# Altium schematic sheet Intelligent_Agriculture_Power.SchDoc
size A4
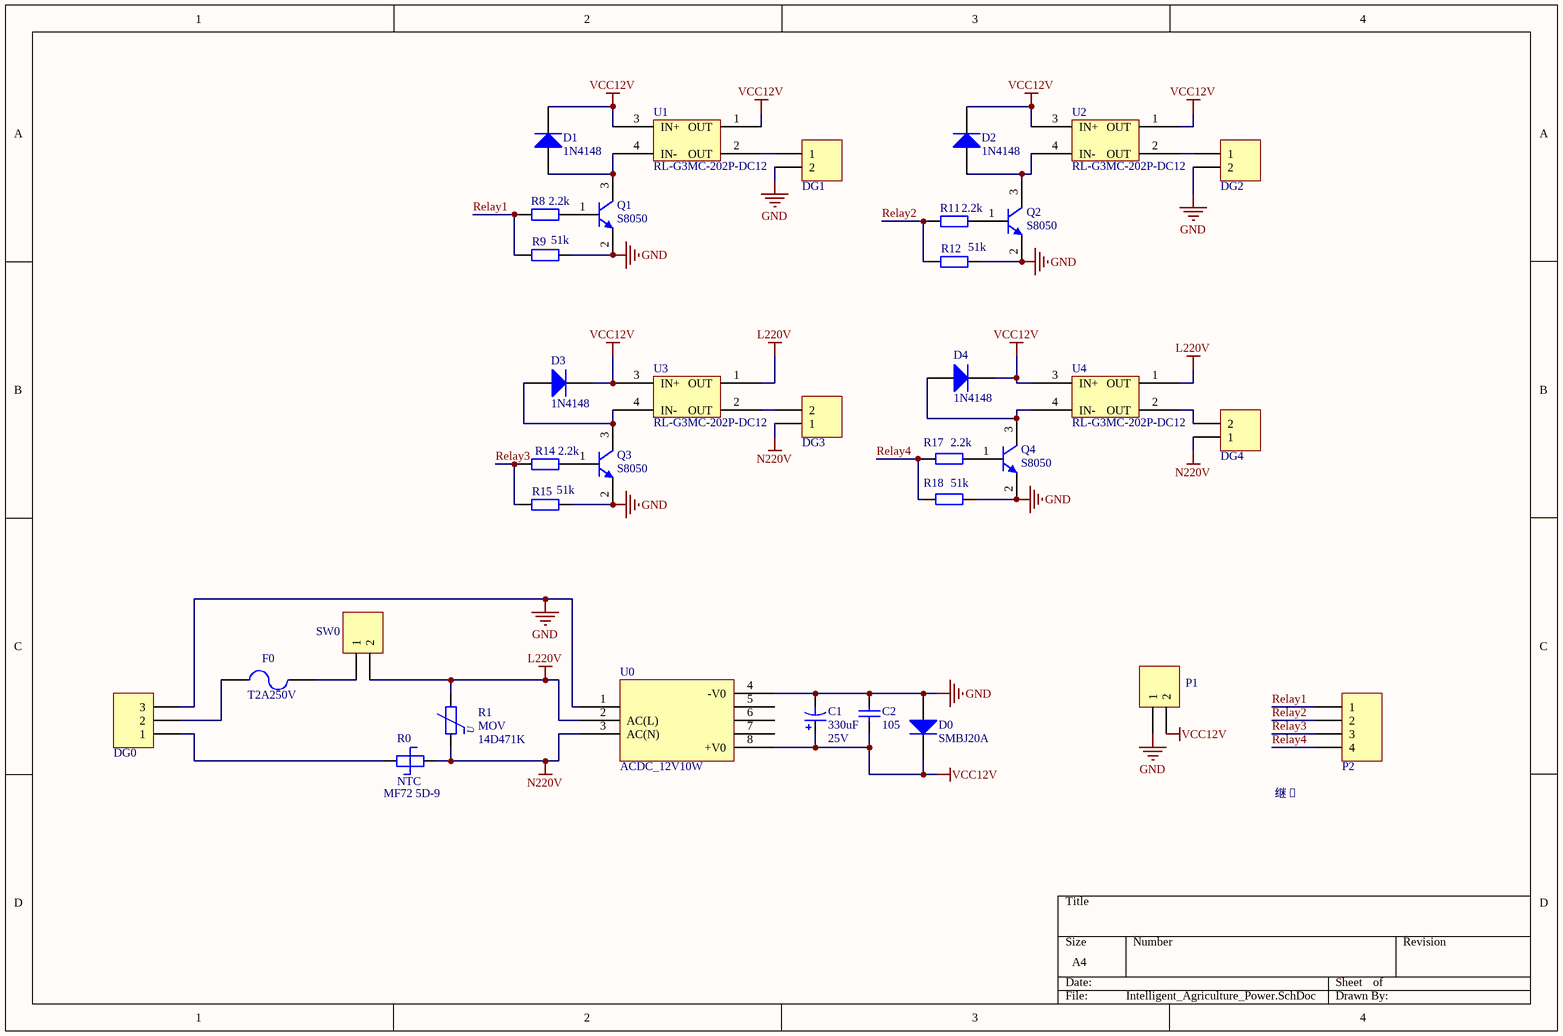
[diagram p0: Intelligent_Agriculture_Power.SchDoc]

## Parts
C1  value 330uF  Vol: 25V  [C-RB-2.54]  (hidden comment: Cap Pol1)
C2  value 105  [C-RAD-0805]  (hidden comment: Cap)
D0  value SMBJ20A  [DIODE-1206]  (hidden comment: Diode)
D1  value 1N4148  [DIODE-1206]  (hidden comment: Diode)
D2  value 1N4148  [DIODE-1206]  (hidden comment: Diode)
D3  value 1N4148  [DIODE-1206]  (hidden comment: Diode)
D4  value 1N4148  [DIODE-1206]  (hidden comment: Diode)
DG0  Header 3  [DG301-3P]  (value not drawn)
DG1  Header 2  [HDR2X1_C]  (value not drawn)
DG2  Header 2  [HDR2X1_C]  (value not drawn)
DG3  Header 2  [HDR2X1_C]  (value not drawn)
DG4  Header 2  [HDR2X1_C]  (value not drawn)
F0  value T2A250V  [1812]  (hidden comment: Fuse)
P1  Header 2  [HDR2X1_B1]  (value not drawn)
P2  Header 4  [HDR4X1_B1]  (value not drawn)
Q1  S8050  [SOT-23]
Q2  S8050  [SOT-23]
Q3  S8050  [SOT-23]
Q4  S8050  [SOT-23]
R0  NTC  value MF72 5D-9  [0805-1]
R1  MOV  value 14D471K  [0805-1]
R8  value 2.2k  [0805-1]  (hidden comment: Res1)
R9  value 51k  [0805-1]  (hidden comment: Res1)
R11  value 2.2k  [0805-1]  (hidden comment: Res1)
R12  value 51k  [0805-1]  (hidden comment: Res1)
R14  value 2.2k  [0805-1]  (hidden comment: Res1)
R15  value 51k  [0805-1]  (hidden comment: Res1)
R17  value 2.2k  [0805-1]  (hidden comment: Res1)
R18  value 51k  [0805-1]  (hidden comment: Res1)
SW0  Header 2  [HDR2X1_C]  (value not drawn)
U0  ACDC_12V10W  [ACDC_XTQ10B-12W]
U1  RL-G3MC-202P-DC12  [RL-G3MC-202P-DC12]
U2  RL-G3MC-202P-DC12  [RL-G3MC-202P-DC12]
U3  RL-G3MC-202P-DC12  [RL-G3MC-202P-DC12]
U4  RL-G3MC-202P-DC12  [RL-G3MC-202P-DC12]

## Nets
GND: C1.2 C2.2 D0.1(A) DG0.3 DG1.2 DG2.2 P1.1 Q1.2(E) Q2.2(E) Q3.2(E) Q4.2(E) R9.2 R12.2 R15.2 R18.2 U0.1 U0.4(-V0)
L220V: R1.2 SW0.2 U0.2(AC(L)) U3.1(OUT) U4.1(OUT)
N220V: DG3.1 DG4.1 R0.2 R1.1 U0.3(AC(N))
VCC12V: C1.1 C2.1 D0.2(K) D1.2(K) D2.2(K) D3.2(K) D4.2(K) P1.2 U0.8(+V0) U1.1(OUT) U1.3(IN+) U2.1(OUT) U2.3(IN+) U3.3(IN+) U4.3(IN+)
Relay1: P2.1 R8.2 R9.1
Relay2: P2.2 R11.2 R12.1
Relay3: P2.3 R14.2 R15.1
Relay4: P2.4 R17.2 R18.1
NetD1_1: D1.1(A) Q1.3(C) U1.4(IN-)
NetD2_1: D2.1(A) Q2.3(C) U2.4(IN-)
NetD3_1: D3.1(A) Q3.3(C) U3.4(IN-)
NetD4_1: D4.1(A) Q4.3(C) U4.4(IN-)
NetDG0_1: DG0.1 R0.1
NetDG0_2: DG0.2 F0.1
NetDG1_1: DG1.1 U1.2(OUT)
NetDG2_1: DG2.1 U2.2(OUT)
NetDG3_2: DG3.2 U3.2(OUT)
NetDG4_2: DG4.2 U4.2(OUT)
NetF0_2: F0.2 SW0.1
NetQ1_1: Q1.1(B) R8.1
NetQ2_1: Q2.1(B) R11.1
NetQ3_1: Q3.1(B) R14.1
NetQ4_1: Q4.1(B) R17.1

Not connected (* = marked no-connect by the designer): U0 5 6 7

## Notes on the sheet
- 继�
- (in symbol MOV) U

## Library data of the parts
C1 = Cap P: 电解电容; Published: 8-Jun-2000; LatestRevisionDate: 17-Jul-2002; LatestRevisionNote: Re-released for DXP Platform.; PackageReference: RB7.6-15; Publisher: Altium Limited; PackageDescription: Polarized Capacitor (Radial); 2 Leads
C2 = Cap: 无极性电容; Published: 8-Jun-2000; LatestRevisionDate: 17-Jul-2002; LatestRevisionNote: Re-released for DXP Platform.; PackageReference: RAD-0.3; Publisher: Altium Limited
D0-D4 = Dio: 二极管; Published: 8-Jun-2000; LatestRevisionDate: 17-Jul-2002; LatestRevisionNote: Re-released for DXP Platform.; PackageDocument: Sep-1996; PackageReference: SMC; Publisher: Altium Limited; Code_JEDEC: DO-214-AB
DG0 = Header: 接插件; Value: 排针; LatestRevisionDate: 17-Jul-2002; LatestRevisionNote: Re-released for DXP Platform.; Publisher: Altium Limited
DG1 DG2 = Header 2: 接插件; LatestRevisionDate: 17-Jul-2002; LatestRevisionNote: Re-released for DXP Platform.; Publisher: Altium Limited
DG3 DG4 SW0 = Header 2: 接插件; Value: 5.08-301-3P; LatestRevisionDate: 17-Jul-2002; LatestRevisionNote: Re-released for DXP Platform.; Publisher: Altium Limited
F0 = Fuse: 保险丝; Published: 8-Jun-2000; LatestRevisionDate: 17-Jul-2002; LatestRevisionNote: Re-released for DXP Platform.; PackageReference: PIN-W2/E2.8; Publisher: Altium Limited
P1 = Header 2: 接插件; Value: XH2.54-2P; LatestRevisionDate: 17-Jul-2002; LatestRevisionNote: Re-released for DXP Platform.; Publisher: Altium Limited
P2 = Header 4: 接插件; Value: XH2.54-4P; LatestRevisionDate: 17-Jul-2002; LatestRevisionNote: Re-released for DXP Platform.; Publisher: Altium Limited
Q1-Q4 = BCP: NPN三极管; Published: 17-Sep-2003; LatestRevisionDate: 12-Dec-2006; LatestRevisionNote: IPC-7351 Footprint Added.; DatasheetVersion: 8-Apr-1999; PackageVersion: Aug-2001; PackageReference: SOT223; Publisher: Altium Limited; PackageDescription: 4-Pin SOT-223 Package 2.3 mm Pitch, 7 mm Lead Span; ComponentLink1Description: Manufacturer Link; ComponentLink1URL: http://www.semiconductors.philips.com/; ComponentLink2Description: Datasheet; ComponentLink2URL: http://www.semiconductors.philips.com/acrobat/datasheets/BCP68_4.pdf; Value: S8050
R0 = NTC: 热敏电阻; Published: 8-Jun-2000; LatestRevisionDate: 17-Jul-2002; LatestRevisionNote: Re-released for DXP Platform.; PackageReference: AXIAL-0.4; Publisher: Altium Limited
R1 = MOV: 压敏电阻; Published: 8-Jun-2000; LatestRevisionDate: 17-Jul-2002; LatestRevisionNote: Re-released for DXP Platform.; PackageReference: AXIAL-0.4; Publisher: Altium Limited
R8 R9 R11 R12 R14 R15 R17 R18 = Res1: 贴片电阻; Published: 8-Jun-2000; LatestRevisionDate: 17-Jul-2002; LatestRevisionNote: Re-released for DXP Platform.; PackageReference: AXIAL-0.4; Publisher: Altium Limited
U0 = ACD: ACDC模块_220VAC转12VDC; Value: XTQ10B-12W
U1-U4 = RL-G3MC-202P-: 12V 固态继电器